# EAGLE design cable_v2 (EAGLE 9.6.2)
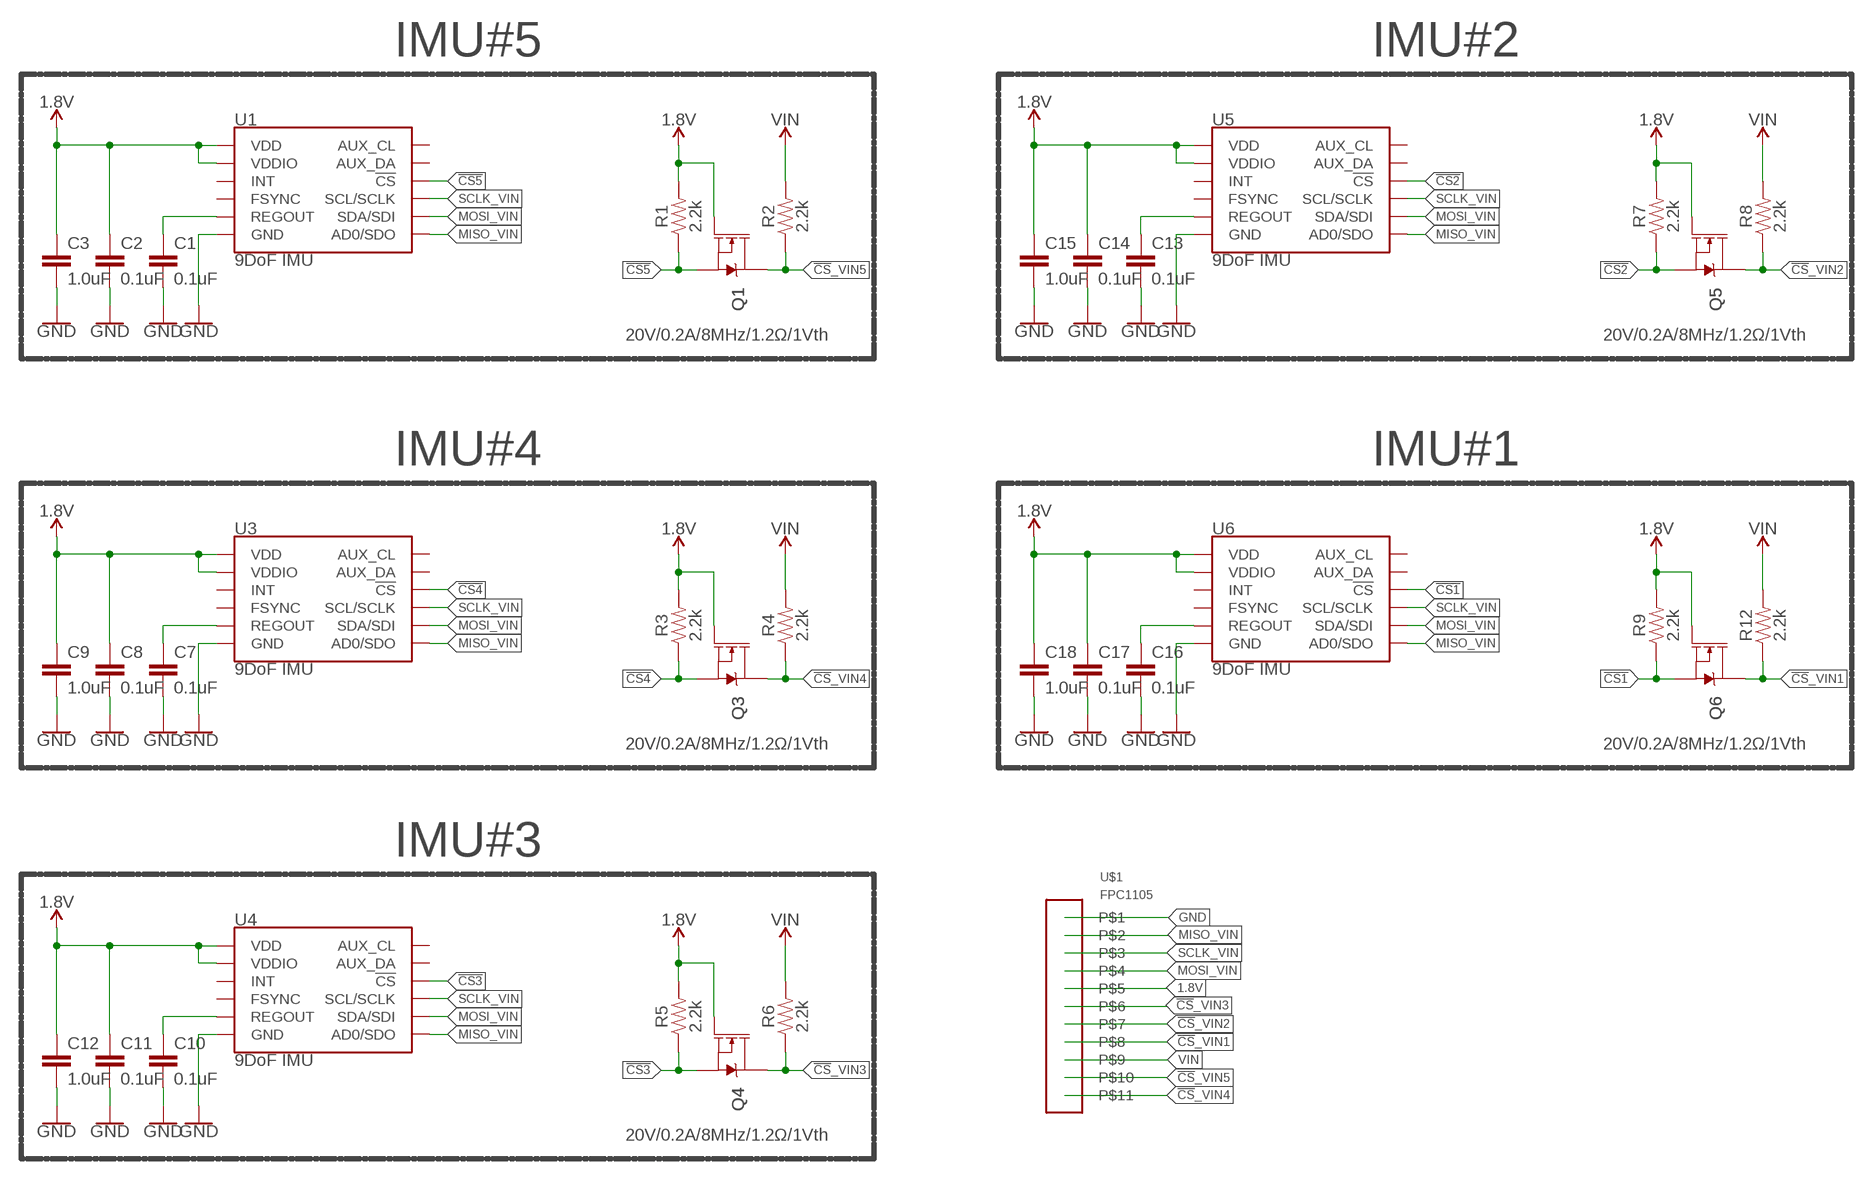
[diagram p0: schematic, sheet 1]

## Parts
C1  0.1uF  C-EUC0402  [C0402]
C2  0.1uF  C-EUC0402  [C0402]
C3  1.0uF  C-EUC0402  [C0402]
C7  0.1uF  C-EUC0402  [C0402]
C8  0.1uF  C-EUC0402  [C0402]
C9  1.0uF  C-EUC0402  [C0402]
C10  0.1uF  C-EUC0402  [C0402]
C11  0.1uF  C-EUC0402  [C0402]
C12  1.0uF  C-EUC0402  [C0402]
C13  0.1uF  C-EUC0402  [C0402]
C14  0.1uF  C-EUC0402  [C0402]
C15  1.0uF  C-EUC0402  [C0402]
C16  0.1uF  C-EUC0402  [C0402]
C17  0.1uF  C-EUC0402  [C0402]
C18  1.0uF  C-EUC0402  [C0402]
Q1  20V/0.2A/8MHz/1.2Ω/1Vth  MOSFET-NCH-RE1C002UN  [SOT-416FL]
Q3  20V/0.2A/8MHz/1.2Ω/1Vth  MOSFET-NCH-RE1C002UN  [SOT-416FL]
Q4  20V/0.2A/8MHz/1.2Ω/1Vth  MOSFET-NCH-RE1C002UN  [SOT-416FL]
Q5  20V/0.2A/8MHz/1.2Ω/1Vth  MOSFET-NCH-RE1C002UN  [SOT-416FL]
Q6  20V/0.2A/8MHz/1.2Ω/1Vth  MOSFET-NCH-RE1C002UN  [SOT-416FL]
R1  2.2k  2.2KOHM-0402T-1/16W-1%  [0402-TIGHT]
R2  2.2k  2.2KOHM-0402T-1/16W-1%  [0402-TIGHT]
R3  2.2k  2.2KOHM-0402T-1/16W-1%  [0402-TIGHT]
R4  2.2k  2.2KOHM-0402T-1/16W-1%  [0402-TIGHT]
R5  2.2k  2.2KOHM-0402T-1/16W-1%  [0402-TIGHT]
R6  2.2k  2.2KOHM-0402T-1/16W-1%  [0402-TIGHT]
R7  2.2k  2.2KOHM-0402T-1/16W-1%  [0402-TIGHT]
R8  2.2k  2.2KOHM-0402T-1/16W-1%  [0402-TIGHT]
R9  2.2k  2.2KOHM-0402T-1/16W-1%  [0402-TIGHT]
R12  2.2k  2.2KOHM-0402T-1/16W-1%  [0402-TIGHT]
U1  9DoF IMU  ICM-20948  [QFN24-3X3]
U3  9DoF IMU  ICM-20948  [QFN24-3X3]
U4  9DoF IMU  ICM-20948  [QFN24-3X3]
U5  9DoF IMU  ICM-20948  [QFN24-3X3]
U6  9DoF IMU  ICM-20948  [QFN24-3X3]
U$1  FPC1105  [FPC1105]

## Nets
1.8V [New Class]: C2.1 C3.1 C8.1 C9.1 C11.1 C12.1 C14.1 C15.1 C17.1 C18.1 Q1.1(G) Q3.1(G) Q4.1(G) Q5.1(G) Q6.1(G) R1.2 R3.2 R5.2 R7.2 R9.2 U1.8(VDDIO) U1.13(VDD) U3.8(VDDIO) U3.13(VDD) U4.8(VDDIO) U4.13(VDD) U5.8(VDDIO) U5.13(VDD) U6.8(VDDIO) U6.13(VDD) U$1.P$5
!CS1: Q6.2(S) R9.1 U6.22(!CS)
!CS2: Q5.2(S) R7.1 U5.22(!CS)
!CS3: Q4.2(S) R5.1 U4.22(!CS)
!CS4: Q3.2(S) R3.1 U3.22(!CS)
!CS5: Q1.2(S) R1.1 U1.22(!CS)
!CS!_VIN1: Q6.3(D) R12.1 U$1.P$8
!CS!_VIN2: Q5.3(D) R8.1 U$1.P$7
!CS!_VIN3: Q4.3(D) R6.1 U$1.P$6
!CS!_VIN4: Q3.3(D) R4.1 U$1.P$11
!CS!_VIN5: Q1.3(D) R2.1 U$1.P$10
GND [New Class]: C1.2 C2.2 C3.2 C7.2 C8.2 C9.2 C10.2 C11.2 C12.2 C13.2 C14.2 C15.2 C16.2 C17.2 C18.2 U1.18(GND) U1.20(GND) U3.18(GND) U3.20(GND) U4.18(GND) U4.20(GND) U5.18(GND) U5.20(GND) U6.18(GND) U6.20(GND) U$1.P$1
MISO_VIN: U1.9(AD0/SDO) U3.9(AD0/SDO) U4.9(AD0/SDO) U5.9(AD0/SDO) U6.9(AD0/SDO) U$1.P$2
MOSI_VIN: U1.24(SDA/SDI) U3.24(SDA/SDI) U4.24(SDA/SDI) U5.24(SDA/SDI) U6.24(SDA/SDI) U$1.P$4
N$2: C1.1 U1.10(REGOUT)
N$3: C7.1 U3.10(REGOUT)
N$4: C10.1 U4.10(REGOUT)
N$5: C13.1 U5.10(REGOUT)
N$6: C16.1 U6.10(REGOUT)
SCLK_VIN: U1.23(SCL/SCLK) U3.23(SCL/SCLK) U4.23(SCL/SCLK) U5.23(SCL/SCLK) U6.23(SCL/SCLK) U$1.P$3
VIN [New Class]: R2.2 R4.2 R6.2 R8.2 R12.2 U$1.P$9
Unconnected: U1.7(AUX_CL) U1.11(FSYNC) U1.12(INT) U1.21(AUX_DA) U3.7(AUX_CL) U3.11(FSYNC) U3.12(INT) U3.21(AUX_DA) U4.7(AUX_CL) U4.11(FSYNC) U4.12(INT) U4.21(AUX_DA) U5.7(AUX_CL) U5.11(FSYNC) U5.12(INT) U5.21(AUX_DA) U6.7(AUX_CL) U6.11(FSYNC) U6.12(INT) U6.21(AUX_DA)

## Notes on the sheet
- IMU#5 | IMU#2
- IMU#4 | IMU#1
- IMU#3

## Library data of the parts
C1-C3 C7-C18 = rcl:C-EU: CAPACITOR, European symbol; SPICEPREFIX: C
Q1 Q3-Q6 = SparkFun-DiscreteSemi:MOSFET-NCH: N-channel MOSFETs Voltage controlled devices that allow control of high current outputs. SparkFun Products: SparkFun OpenScale <https://www.sparkfun.com/products/13261> SparkFun Digital Sandbox <https://www.sparkfun.com/products/12651> SparkFun Monster Moto Shield <https://www.sparkfun.com/products/10182> SparkFun MOSFET Power Controller <https://www.sparkfun.com/products/11214>; PROD_ID: TRANS_14399
R1-R9 R12 = SparkFun-Resistors:2.2KOHM: 2.2kΩ resistor A resistor is a passive two-terminal electrical component that implements electrical resistance as a circuit element. Resistors act to reduce current flow, and, at the same time, act to lower voltage levels within circuits. - Wikipedia; PROD_ID: RES-14341
U1 U3-U6 = SparkFun-Sensors:ICM-20948: ICM-20948 9 Degree of Freedom IMU World’s lowest power 9-axis MotionTracking device that is ideally suited for smartphones, tablets, wearable sensors, and IoT applications. Includes onboard Digital Motion Processor to offload computations from the host processor Datasheet <https://cdn.sparkfun.com/assets/learn_tutorials/5/5/0/MPU9250REV1.0.pdf> SparkFun Products: SparkFun IMU Breakout - ICM-20948 <https://www.sparkfun.com/products/15182>; PROD_ID: IC-14247
U$1 = my_library:FPC1105

## Net classes
0 default: width 0.203 mm
1 New Class: width 0.203 mm

## Board
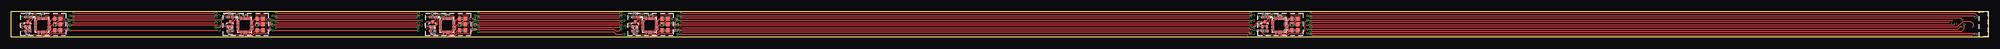
[diagram p1: board, top side]
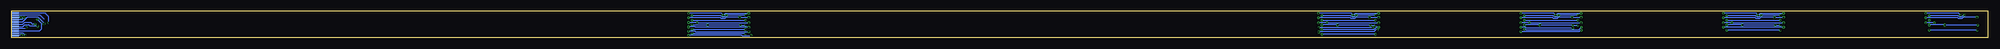
[diagram p2: board, bottom side, seen from below]

Size 439.4 x 5.8 mm. Coordinates in mm from the lower left corner, seen from the top.
Outline: 0,0 0,5.8 439.4,5.8 439.4,0 0,0
Copper layers (1*16): Top 0.035mm / dielectric 1.6mm / Bottom 0.035mm
Design rules "jlcpcb-2layers *": minimum track width 5mil, minimum drill 0.3mm, track to track 5mil, track to pad 5mil, pad to pad 5mil, via to via 5mil, smd to smd 5mil, copper to edge 0.2mm, drill to drill 6mil, minimum pad ring 10mil, minimum via ring 3mil, stop-mask expansion 4mil, vias tented up to drill 20mil, thermal gap 10mil

### Footprints (pad centres in the part's own frame; a part is rotated, then mirrored left to right if it is on the bottom)
C0402 = smd 0.7 x 0.9: 1 -0.65,0; 2 0.65,0
SOT-416FL = smd 0.46 x 0.65: 1 -0.5,-1.1; 2 0.5,-1.1; 3 0,0.05
0402-TIGHT = smd 0.6 x 0.6: 1 -0.5,0; 2 0.5,0
QFN24-3X3 = smd 0.495 x 0.25: 1 -1.552,1; 6 -1.552,-1; 13 1.552,-1; 18 1.552,1 | smd 0.6 x 0.25: 2 -1.5,0.6; 3 -1.5,0.2; 4 -1.5,-0.2; 5 -1.5,-0.6; 14 1.5,-0.6; 15 1.5,-0.2; 16 1.5,0.2; 17 1.5,0.6 | smd 0.25 x 0.495: 7 -1,-1.552; 12 1,-1.552; 19 1,1.552; 24 -1,1.552 | smd 0.25 x 0.6: 8 -0.6,-1.5; 9 -0.2,-1.5; 10 0.2,-1.5; 11 0.6,-1.5; 20 0.6,1.5; 21 0.2,1.5; 22 -0.2,1.5; 23 -0.6,1.5
FPC1105 = smd 0.3 x 1.7: P$1 -2,0; P$2 -1.5,0; P$3 -1,0; P$4 -0.5,0; P$5 0,0; P$6 0.5,0; P$7 1,0; P$8 1.5,0; P$9 2,0; P$10 2.5,0; P$11 3,0

### Placement (x,y rotation side)
C1  10.3,1.6 0 top
C2  10.3,2.9 0 top
C3  10.3,4.1 180 top
C7  55.3,1.6 0 top
C8  55.3,2.9 0 top
C9  55.3,4.1 180 top
C10  100.3,1.6 0 top
C11  100.3,2.9 0 top
C12  100.3,4.1 180 top
C13  145.3,1.6 0 top
C14  145.3,2.9 0 top
C15  145.3,4.1 180 top
C16  285.3,1.6 0 top
C17  285.3,2.9 0 top
C18  285.3,4.1 180 top
Q1  3.64,3.46 0 top
Q3  48.64,3.46 0 top
Q4  93.64,3.46 0 top
Q5  138.64,3.46 0 top
Q6  278.64,3.46 0 top
R1  3.67,1.42 180 top
R2  3.71,4.52 180 top
R3  48.67,1.42 180 top
R4  48.71,4.52 180 top
R5  93.67,1.42 180 top
R6  93.71,4.52 180 top
R7  138.67,1.42 180 top
R8  138.71,4.52 180 top
R9  278.67,1.42 180 top
R12  278.71,4.52 180 top
U1  6.86,2.7 0 top
U3  51.86,2.7 0 top
U4  96.86,2.7 0 top
U5  141.86,2.7 0 top
U6  281.86,2.7 0 top
U$1  438.6,3.4 270 bottom

### Tracks (layer width: path | path; a pad name or v marks a point on that pad's centre or on a via)
1.8V  (via drill 0.3, 0.35)
  Top 0.203: U1.13 8.8,1.7 8.91,1.81 8.91,2.6 9.08,2.76 9.63,2.76 | C3.1 10.95,4.02 10.35,3.42 10.17,3.42 C2.1 9.63,2.88 9.63,2.76 | v2.34,2.72 2.7,2.36 Q1.1 3.17,2.33 R1.2 3.17,0.96 3.53,0.6 6,0.6 6.07,0.67 6.08,0.67 6.26,0.85 U1.8 | 9.63,2.76 v9.65,2.74 | U3.13 53.8,1.7 53.91,1.81 53.91,2.6 54.08,2.76 54.63,2.76 | C9.1 55.95,4.02 55.35,3.42 55.17,3.42 C8.1 54.63,2.88 54.63,2.76 | v47.34,2.72 47.7,2.36 Q3.1 48.17,2.33 R3.2 48.17,0.96 48.53,0.6 51,0.6 51.07,0.67 51.08,0.67 51.26,0.85 U3.8 | 54.63,2.76 v54.65,2.74 | U4.13 98.8,1.7 98.91,1.81 98.91,2.6 99.08,2.76 99.63,2.76 | C12.1 100.95,4.02 100.35,3.42 100.17,3.42 C11.1 99.63,2.88 99.63,2.76 | v92.34,2.72 92.7,2.36 Q4.1 93.17,2.33 R5.2 93.17,0.96 93.53,0.6 96,0.6 96.07,0.67 96.08,0.67 96.26,0.85 U4.8 | 99.63,2.76 v99.65,2.74 | U5.13 143.8,1.7 143.91,1.81 143.91,2.6 144.08,2.76 144.63,2.76 | C15.1 145.95,4.02 145.35,3.42 145.17,3.42 C14.1 144.63,2.88 144.63,2.76 | v137.34,2.72 137.7,2.36 Q5.1 138.17,2.33 R7.2 138.17,0.96 138.53,0.6 141,0.6 141.07,0.67 141.08,0.67 141.26,0.85 U5.8 | 144.63,2.76 v144.65,2.74 | U6.13 283.8,1.7 283.91,1.81 283.91,2.6 284.08,2.76 284.63,2.76 | C18.1 285.95,4.02 285.35,3.42 285.17,3.42 C17.1 284.63,2.88 284.63,2.76 | U6.8 281.26,0.85 281.08,0.67 281.07,0.67 281,0.6 278.53,0.6 278.17,0.96 R9.2 278.17,2.33 Q6.1 277.7,2.36 v277.34,2.72 | 284.63,2.76 v284.65,2.74 | v13.1,2.74 46.17,2.74 v46.2,2.72 | v58.1,2.74 91.17,2.74 v91.2,2.72 | v103.1,2.74 136.17,2.74 v136.2,2.72 | v148.1,2.74 276.17,2.74 v276.2,2.72 | v432.2,3.02 431.95,2.77 288.18,2.77 v288.1,2.84
  Bottom 0.203: v2.34,2.72 9.62,2.72 v9.65,2.74 v13.1,2.74 | v46.2,2.72 v47.34,2.72 54.62,2.72 v54.65,2.74 v58.1,2.74 | v91.2,2.72 v92.34,2.72 99.62,2.72 v99.65,2.74 v103.1,2.74 | v136.2,2.72 v137.34,2.72 144.62,2.72 v144.65,2.74 v148.1,2.74 | v276.2,2.72 v277.34,2.72 284.62,2.72 v284.65,2.74 288,2.74 v288.1,2.84 | v432.2,3.02 432.2,3.22 433.48,4.5 435.86,4.5 436.96,3.4 U$1.P$5
!CS1
  Top 0.203: R9.1 279.14,1.45 Q6.2 279.14,3.14 279.83,3.83 279.83,4.88 280.31,5.35 281.37,5.35 281.63,5.09 281.63,4.23 U6.22
!CS2
  Top 0.203: R7.1 139.17,2.33 Q5.2 139.83,3.05 139.83,4.88 140.31,5.35 141.37,5.35 141.63,5.09 141.63,4.23 U5.22
!CS3
  Top 0.203: R5.1 94.14,1.45 Q4.2 94.83,3.05 94.83,4.88 95.31,5.35 96.37,5.35 96.63,5.09 96.63,4.23 U4.22
!CS4
  Top 0.203: R3.1 49.14,1.45 Q3.2 49.14,3.23 50.05,4.13 50.05,5.09 50.31,5.35 51.37,5.35 51.66,5.06 U3.22
!CS5
  Top 0.203: U1.22 6.66,5.14 6.4,5.4 5,5.4 4.74,5.14 4.74,3.97 4.14,3.37 Q1.2 4.17,2.33 R1.1
!CS!_VIN1  (via drill 0.3)
  Top 0.203: R12.1 279.21,3.91 278.81,3.51 Q6.3 277.11,3.51 276.66,3.05 276.66,2.53 276.32,2.2 v275.5,2.2 | v436.16,2.2 436.16,3.04 435.61,3.59 433.9,3.59 432.61,2.3 v288.9,2.3
  Bottom 0.203: v275.5,2.2 287.3,2.2 287.4,2.3 v288.9,2.3 | v436.16,2.2 436.46,1.9 U$1.P$8
!CS!_VIN2  (via drill 0.3)
  Top 0.203: R8.1 139.21,3.91 138.81,3.51 Q5.3 138.3,3.17 137.15,3.17 136.88,2.91 136.88,2.18 v136.8,2.1 | v148.8,2.1 274.96,2.1 275.31,1.75 v276.2,1.75 | v288.1,1.84 432.7,1.84 433.36,2.5 v433.6,2.5
  Bottom 0.203: v136.8,2.1 v148.8,2.1 | v276.2,1.75 276.3,1.84 v288.1,1.84 | v433.6,2.5 435.21,2.5 435.57,2.85 436.44,2.85 436.9,2.4 U$1.P$7
!CS!_VIN3  (via drill 0.3)
  Top 0.203: R6.1 94.21,3.91 93.81,3.51 Q4.3 92.41,3.51 91.88,2.98 91.88,2.53 v92.36,2.06 | v103.9,2.25 v135.44,2.25 | v148.1,1.65 274.95,1.65 275.18,1.42 275.38,1.42 v275.5,1.29 | v288.9,1.39 433.53,1.39 434.1,1.96 v434.1,2.95
  Bottom 0.203: v92.36,2.06 102.71,2.06 102.91,2.25 v103.9,2.25 | v135.44,2.25 136,2.25 136.61,1.65 v148.1,1.65 | v275.5,1.29 287.3,1.29 287.4,1.39 v288.9,1.39 | v434.1,2.95 434.8,2.95 435.15,3.3 436.5,3.3 436.9,2.9 U$1.P$6
!CS!_VIN4  (via drill 0.3)
  Top 0.203: Q3.3 48.81,3.51 49.21,3.91 R4.1 49.21,4.99 48.9,5.3 47.72,5.3 46.8,4.38 46.8,2.55 46.5,2.25 v45.5,2.25 | v135.8,1.65 135.3,1.65 135,1.35 134.5,1.35 134.05,1.8 v103.1,1.8 | v90.45,2.25 v58.89,2.25 | v148.8,1.19 274.93,1.19 275.29,0.84 v276.2,0.84 | v437.16,0.43 436.66,0.94 v288.1,0.94
  Bottom 0.203: v45.5,2.25 v58.89,2.25 | v90.45,2.25 91.11,1.6 102.73,1.6 102.92,1.8 v103.1,1.8 | v135.8,1.65 136.14,1.65 136.6,1.19 v148.8,1.19 | v276.2,0.84 276.3,0.94 v288.1,0.94 | v437.16,0.43 438.57,0.43 U$1.P$11
!CS!_VIN5  (via drill 0.3)
  Top 0.203: R2.1 4.21,4.08 Q1.3 3.3,3.17 2.15,3.17 1.88,2.91 1.88,2.53 2.4,2.01 v2.4,1.6 | v13.1,1.6 v46.2,1.6 | v58.1,1.6 90.47,1.6 v90.48,1.58 | v103.9,1.27 133.84,1.27 134.41,0.7 v136.2,0.7 | v148.1,0.7 274.78,0.7 v275.05,0.43 | v288.9,0.43 v436.3,0.43
  Bottom 0.203: v2.4,1.6 v13.1,1.6 | v46.2,1.6 v58.1,1.6 | v90.48,1.58 90.66,1.58 90.97,1.27 v103.9,1.27 | v136.2,0.7 v148.1,0.7 | v275.05,0.43 275.14,0.34 277.05,0.34 277.13,0.43 v288.9,0.43 | v436.3,0.43 436.77,0.9 U$1.P$10
GND  (via drill 0.3, 0.35)
  Top 0.203: U1.20 7.5,4.25 7.5,4.59 7.68,4.77 8.2,4.77 8.4,4.57 8.4,3.71 U1.18 8.8,3.7 9.2,4.1 C3.2 | C2.2 11.25,3.2 v12,3.2 | U3.20 52.51,4.25 52.51,4.59 52.68,4.77 53.2,4.77 53.4,4.57 53.4,3.71 U3.18 53.8,3.7 54.2,4.1 C9.2 | C8.2 56.25,3.2 v57,3.2 | U4.20 97.5,4.25 97.5,4.59 97.68,4.77 98.2,4.77 98.4,4.57 98.4,3.71 U4.18 98.8,3.7 99.2,4.1 C12.2 | C11.2 101.25,3.2 v102,3.2 | U5.20 142.5,4.25 142.5,4.59 142.68,4.77 143.2,4.77 143.4,4.57 143.4,3.71 U5.18 143.8,3.7 144.2,4.1 C15.2 | C14.2 146.25,3.2 v147,3.2 | U6.20 282.5,4.25 282.5,4.59 282.68,4.77 283.2,4.77 283.4,4.57 283.4,3.71 U6.18 283.8,3.7 284.2,4.1 C18.2 | C17.2 286.25,3.2 v287,3.2 | v13.9,3.2 v45.5,3.2 | v58.9,3.2 v90.5,3.2 | v103.9,3.2 v135.5,3.2 | v148.9,3.2 v275.5,3.2 | v431.1,3.25 289,3.25 v288.9,3.3
  Bottom 0.203: v12,3.2 v13.9,3.2 | v45.5,3.2 v57,3.2 v58.9,3.2 | v90.5,3.2 v102,3.2 v103.9,3.2 | v135.5,3.2 v147,3.2 v148.9,3.2 | v275.5,3.2 v287,3.2 287.1,3.3 v288.9,3.3 | v431.1,3.25 431.1,4.6 431.9,5.4 U$1.P$1
  pour Top: 9.3,5 9.3,3.6 10,3.6 10,4.4 10.2,4.6 11.3,4.6 11.3,3.5 10.7,3.5 10.5,3.3 10.5,1.3 10.6,1.2 11.5,1.2 11.7,1.4 11.7,5
  pour Top: 54.3,5 54.3,3.6 55,3.6 55,4.4 55.2,4.6 56.3,4.6 56.3,3.5 55.7,3.5 55.5,3.3 55.5,1.3 55.6,1.2 56.5,1.2 56.7,1.4 56.7,5
  pour Top: 99.3,4.7 99.3,3.6 100,3.6 100,4.4 100.1,4.5 100.2,4.6 101.3,4.6 101.3,3.5 100.7,3.5 100.6,3.4 100.5,3.3 100.5,1.3 100.6,1.2 101.5,1.2 101.7,1.4 101.7,5 99.3,5
  pour Top: 144.3,4.7 144.3,3.6 145,3.6 145,4.4 145.1,4.5 145.2,4.6 146.3,4.6 146.3,3.5 145.7,3.5 145.6,3.4 145.5,3.3 145.5,1.3 145.6,1.2 146.5,1.2 146.7,1.4 146.7,5 144.3,5
  pour Top: 284.3,5 284.3,3.6 285,3.6 285,4.4 285.2,4.6 286.3,4.6 286.3,3.5 285.7,3.5 285.5,3.3 285.5,1.3 285.6,1.2 286.5,1.2 286.7,1.4 286.7,5
MISO_VIN  (via drill 0.3, 0.35)
  Top 0.203: U1.9 6.71,1.15 6.71,0.74 7.1,0.34 8.51,0.34 9.07,0.9 11.9,0.9 12.5,1.5 12.5,3.2 v13.1,3.8 v46.2,3.8 | U3.9 51.71,1.15 51.71,0.74 52.1,0.34 53.51,0.34 54.07,0.9 56.9,0.9 57.5,1.5 57.5,3.2 v58.1,3.8 v91.2,3.8 | U4.9 96.71,1.15 96.71,0.74 97.1,0.34 98.51,0.34 99.07,0.9 101.9,0.9 102.5,1.5 102.5,3.2 v103.1,3.8 v136.2,3.8 | U5.9 141.71,1.15 141.71,0.74 142.1,0.34 143.51,0.34 144.07,0.9 146.9,0.9 147.5,1.5 147.5,3.2 v148.1,3.8 v276.2,3.8 | U6.9 281.66,0.78 282.1,0.34 283.51,0.34 284.07,0.9 286.9,0.9 287.5,1.5 287.5,3.2 v288.1,3.8 v431.9,3.8
  Bottom 0.203: v58.1,3.8 51.66,3.8 51.64,3.78 50.72,3.78 50.7,3.8 v46.2,3.8 | v103.1,3.8 96.66,3.8 96.64,3.78 95.72,3.78 95.7,3.8 v91.2,3.8 | v148.1,3.8 141.66,3.8 141.64,3.78 140.72,3.78 140.7,3.8 v136.2,3.8 | v288.1,3.8 281.66,3.8 281.64,3.78 280.72,3.78 280.7,3.8 v276.2,3.8 | v431.9,3.8 433,4.9 U$1.P$2
MOSI_VIN  (via drill 0.3, 0.35)
  Top 0.203: U1.24 5.86,4.54 5.5,4.9 v5.3,4.9 | U3.24 50.86,4.54 v50.5,4.9 | U4.24 95.86,4.54 v95.5,4.9 | U5.24 140.86,4.54 v140.5,4.9 | U6.24 280.86,4.54 v280.5,4.9 | v13.1,4.8 45.22,4.8 45.31,4.89 v46.2,4.89 | v58.1,4.8 90.22,4.8 90.31,4.89 v91.2,4.89 | v103.1,4.8 135.22,4.8 135.31,4.89 v136.2,4.89 | v148.1,4.8 275.22,4.8 275.31,4.89 v276.2,4.89 | v436.62,4.42 436.24,4.8 v288.1,4.8
  Bottom 0.203: v13.1,4.8 6.7,4.8 6.63,4.73 6.63,4.71 6.37,4.44 5.99,4.44 5.54,4.9 v5.3,4.9 | v46.2,4.89 v50.49,4.89 v50.5,4.9 50.54,4.9 50.99,4.44 51.37,4.44 51.63,4.71 51.63,4.73 51.7,4.8 v58.1,4.8 | v91.2,4.89 v95.49,4.89 v95.5,4.9 95.54,4.9 95.99,4.44 96.37,4.44 96.63,4.71 96.63,4.73 96.7,4.8 v103.1,4.8 | v136.2,4.89 v140.49,4.89 v140.5,4.9 140.54,4.9 140.99,4.44 141.37,4.44 141.63,4.71 141.63,4.73 141.7,4.8 v148.1,4.8 | v276.2,4.89 v280.49,4.89 v280.5,4.9 280.54,4.9 280.99,4.44 281.37,4.44 281.63,4.71 281.63,4.73 281.7,4.8 v288.1,4.8 | v436.62,4.42 437.1,3.94 438.56,3.94 U$1.P$4
N$2
  Top 0.203: U1.10 7.06,0.85 7.24,0.67 8.37,0.67 9.3,1.6 C1.1
N$3
  Top 0.203: U3.10 52.06,0.85 52.24,0.67 53.37,0.67 54.3,1.6 C7.1
N$4
  Top 0.203: U4.10 97.06,0.85 97.24,0.67 98.37,0.67 99.3,1.6 C10.1
N$5
  Top 0.203: U5.10 142.06,0.85 142.24,0.67 143.37,0.67 144.3,1.6 C13.1
N$6
  Top 0.203: U6.10 282.06,0.85 282.24,0.67 283.37,0.67 284.3,1.6 C16.1
SCLK_VIN  (via drill 0.3, 0.35)
  Top 0.203: U1.23 6.26,4.82 v6.18,4.9 | U3.23 51.26,4.82 v51.18,4.9 | U4.23 96.26,4.82 v96.18,4.9 | U5.23 141.26,4.82 v141.18,4.9 | U6.23 281.26,4.82 v281.18,4.9 | v13.9,5.3 45.45,5.3 v45.5,5.35 | v58.9,5.3 90.45,5.3 v90.5,5.35 | v103.9,5.3 135.45,5.3 v135.5,5.35 | v148.9,5.3 275.45,5.3 v275.5,5.35 | v288.9,5.3 436.42,5.3 v437.3,4.42
  Bottom 0.203: v13.9,5.3 13.8,5.3 13.79,5.3 6.58,5.3 v6.18,4.9 | v58.9,5.3 58.8,5.3 51.58,5.3 v51.18,4.9 51.14,4.9 50.69,5.35 v45.5,5.35 | v103.9,5.3 103.8,5.3 103.79,5.3 96.58,5.3 v96.18,4.9 96.14,4.9 95.69,5.35 v90.5,5.35 | v148.9,5.3 148.8,5.3 148.79,5.3 141.58,5.3 v141.18,4.9 141.14,4.9 140.69,5.35 v135.5,5.35 | v288.9,5.3 288.8,5.3 281.58,5.3 v281.18,4.9 281.14,4.9 280.69,5.35 v275.5,5.35 | v437.3,4.42 438.58,4.42 U$1.P$3
VIN  (via drill 0.3)
  Top 0.203: R2.2 2.59,4.52 v2.5,4.43 | R4.2 47.59,4.52 v47.5,4.43 | R6.2 92.58,4.52 v92.5,4.43 | R8.2 137.59,4.52 v137.5,4.43 | R12.2 277.59,4.52 v277.5,4.43 | v13.9,4.34 45.41,4.34 v45.5,4.43 | v58.9,4.34 90.41,4.34 v90.5,4.43 | v103.9,4.34 135.41,4.34 v135.5,4.43 | v148.9,4.34 275.41,4.34 v275.5,4.43 | v288.9,4.34 433,4.34 433.37,4.34 v433.67,4.04
  Bottom 0.203: v2.5,4.43 5.53,4.43 5.85,4.12 6.5,4.12 6.73,4.34 v13.9,4.34 | v45.5,4.43 v47.5,4.43 50.53,4.43 50.85,4.12 51.51,4.12 51.73,4.34 v58.9,4.34 | v90.5,4.43 v92.5,4.43 95.53,4.43 95.85,4.12 96.5,4.12 96.73,4.34 v103.9,4.34 | v135.5,4.43 v137.5,4.43 140.53,4.43 140.85,4.12 141.5,4.12 141.73,4.34 v148.9,4.34 | v275.5,4.43 v277.5,4.43 280.53,4.43 280.85,4.12 281.5,4.12 281.74,4.34 v288.9,4.34 | v433.67,4.04 432.8,3.18 432.8,1.8 433.2,1.4 U$1.P$9